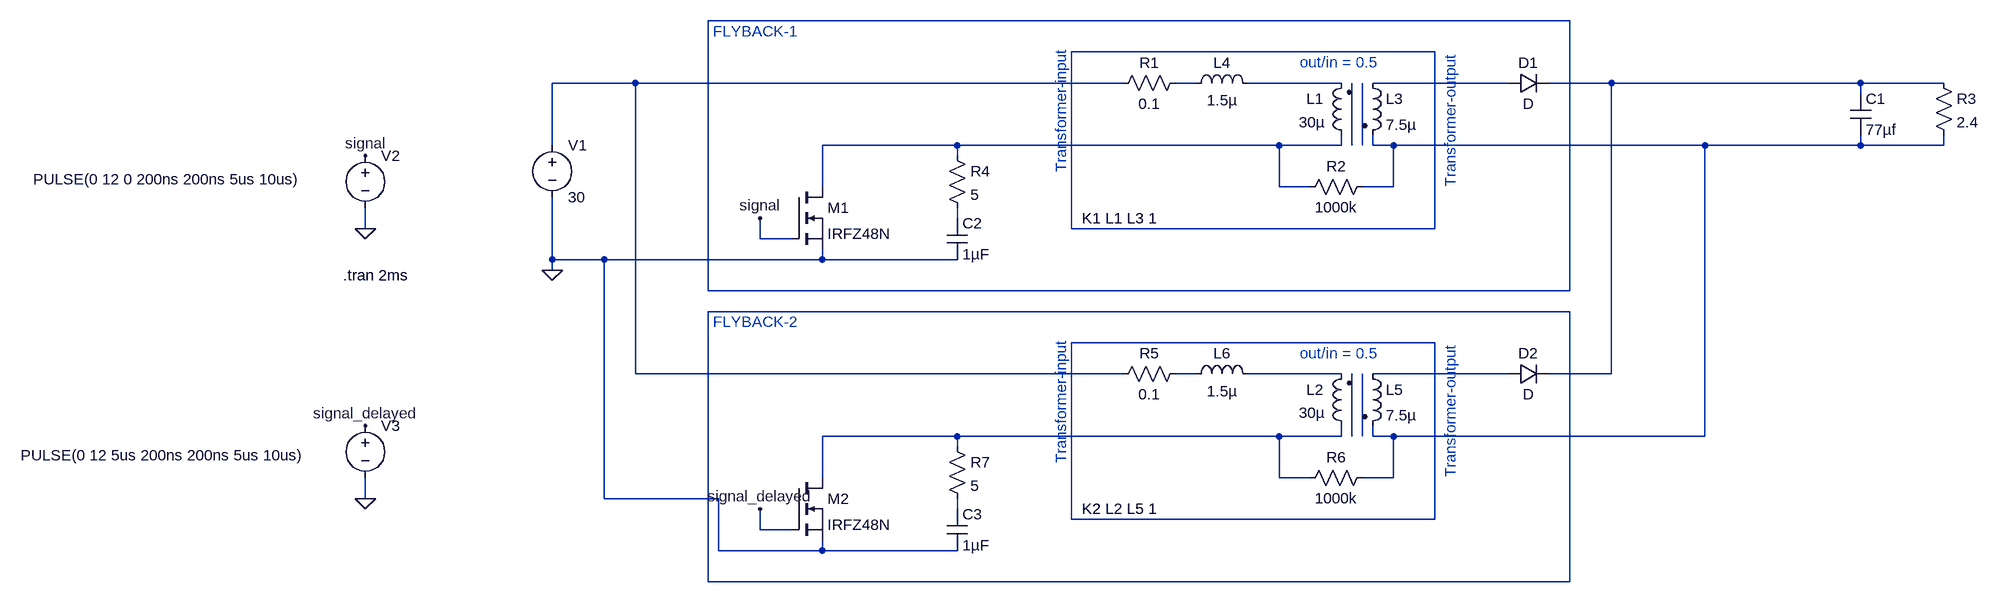
[diagram p0: schematic interleaved_flyback_circuit.asc]
interleaved_flyback_circuit.asc, the LTspice schematic file:
Version 4
SHEET 1 2268 788
WIRE 1632 -80 304 -80
WIRE 1424 -32 864 -32
WIRE 192 16 64 16
WIRE 944 16 192 16
WIRE 1056 16 1024 16
WIRE 1280 16 1136 16
WIRE 1536 16 1328 16
WIRE 1696 16 1600 16
WIRE 2080 16 1696 16
WIRE 2208 16 2080 16
WIRE 2080 32 2080 16
WIRE 64 112 64 16
WIRE 688 112 480 112
WIRE 1184 112 688 112
WIRE 1280 112 1280 96
WIRE 1280 112 1184 112
WIRE 1296 112 1296 16
WIRE 1312 112 1312 16
WIRE 1328 112 1328 96
WIRE 1360 112 1328 112
WIRE 1840 112 1360 112
WIRE 2080 112 2080 96
WIRE 2080 112 1840 112
WIRE 2208 112 2208 96
WIRE 2208 112 2080 112
WIRE 688 128 688 112
WIRE 480 176 480 112
WIRE 1184 176 1184 112
WIRE 1232 176 1184 176
WIRE 1360 176 1360 112
WIRE 1360 176 1312 176
WIRE 688 224 688 208
WIRE -224 240 -224 208
WIRE 864 240 864 -32
WIRE 1424 240 1424 -32
WIRE 1424 240 864 240
WIRE 384 256 384 224
WIRE 432 256 384 256
WIRE 64 288 64 192
WIRE 144 288 64 288
WIRE 480 288 480 272
WIRE 480 288 144 288
WIRE 688 288 480 288
WIRE 64 304 64 288
WIRE 304 336 304 -80
WIRE 1632 336 1632 -80
WIRE 1632 336 304 336
WIRE 1632 368 304 368
WIRE 1424 416 864 416
WIRE 192 464 192 16
WIRE 944 464 192 464
WIRE 1056 464 1024 464
WIRE 1280 464 1136 464
WIRE 1536 464 1328 464
WIRE 1696 464 1696 16
WIRE 1696 464 1600 464
WIRE 688 560 480 560
WIRE 1184 560 688 560
WIRE 1280 560 1280 544
WIRE 1280 560 1184 560
WIRE 1296 560 1296 464
WIRE 1312 560 1312 464
WIRE 1328 560 1328 544
WIRE 1360 560 1328 560
WIRE 1840 560 1840 112
WIRE 1840 560 1360 560
WIRE 688 576 688 560
WIRE 480 624 480 560
WIRE 1184 624 1184 560
WIRE 1232 624 1184 624
WIRE 1360 624 1360 560
WIRE 1360 624 1312 624
WIRE -224 656 -224 624
WIRE 144 656 144 288
WIRE 320 656 144 656
WIRE 688 672 688 656
WIRE 864 688 864 416
WIRE 1424 688 1424 416
WIRE 1424 688 864 688
WIRE 384 704 384 672
WIRE 432 704 384 704
WIRE 320 736 320 656
WIRE 480 736 480 720
WIRE 480 736 320 736
WIRE 688 736 480 736
WIRE 304 784 304 368
WIRE 1632 784 1632 368
WIRE 1632 784 304 784
FLAG 64 304 0
FLAG -224 240 0
FLAG -224 128 signal
FLAG -224 656 0
FLAG -224 544 signal_delayed
FLAG 384 672 signal_delayed
FLAG 384 224 signal
SYMBOL voltage 64 96 R0
WINDOW 123 0 0 Left 0
WINDOW 39 0 0 Left 0
SYMATTR InstName V1
SYMATTR Value 30
SYMBOL voltage -224 112 R0
WINDOW 3 -512 52 Left 2
WINDOW 123 0 0 Left 0
WINDOW 39 0 0 Left 0
SYMATTR InstName V2
SYMATTR Value PULSE(0 12 0 200ns 200ns 5us 10us)
SYMBOL cap 2064 32 R0
SYMATTR InstName C1
SYMATTR Value 77µf
SYMATTR SpiceLine2 IC=12
SYMBOL res 2192 0 R0
SYMATTR InstName R3
SYMATTR Value 2.4
SYMBOL nmos 432 624 R0
SYMATTR InstName M2
SYMATTR Value IRFZ48N
SYMBOL ind2 1296 560 R180
WINDOW 0 43 72 Left 2
WINDOW 3 41 36 Left 2
SYMATTR InstName L2
SYMATTR Value 30µ
SYMATTR Type ind
SYMATTR SpiceLine2 IC=0
SYMBOL ind2 1312 448 R0
SYMATTR InstName L5
SYMATTR Value 7.5µ
SYMATTR Type ind
SYMBOL ind 1040 480 R270
WINDOW 0 32 56 VTop 2
WINDOW 3 5 56 VBottom 2
SYMATTR InstName L6
SYMATTR Value 1.5µ
SYMATTR SpiceLine2 IC=0
SYMBOL res 1040 448 R90
WINDOW 0 0 56 VBottom 2
WINDOW 3 32 56 VTop 2
SYMATTR InstName R5
SYMATTR Value 0.1
SYMBOL res 1328 608 R90
WINDOW 0 0 56 VBottom 2
WINDOW 3 32 56 VTop 2
SYMATTR InstName R6
SYMATTR Value 1000k
SYMBOL diode 1536 480 R270
WINDOW 0 32 32 VTop 2
WINDOW 3 0 32 VBottom 2
SYMATTR InstName D2
SYMBOL res 672 560 R0
SYMATTR InstName R7
SYMATTR Value 5
SYMBOL cap 672 672 R0
SYMATTR InstName C3
SYMATTR Value 1µF
SYMBOL voltage -224 528 R0
WINDOW 3 -531 61 Left 2
WINDOW 123 0 0 Left 0
WINDOW 39 0 0 Left 0
SYMATTR InstName V3
SYMATTR Value PULSE(0 12 5us 200ns 200ns 5us 10us)
SYMBOL nmos 432 176 R0
SYMATTR InstName M1
SYMATTR Value IRFZ48N
SYMBOL ind2 1296 112 R180
WINDOW 0 43 72 Left 2
WINDOW 3 41 36 Left 2
SYMATTR InstName L1
SYMATTR Value 30µ
SYMATTR Type ind
SYMATTR SpiceLine2 IC=0
SYMBOL ind2 1312 0 R0
SYMATTR InstName L3
SYMATTR Value 7.5µ
SYMATTR Type ind
SYMBOL ind 1040 32 R270
WINDOW 0 32 56 VTop 2
WINDOW 3 5 56 VBottom 2
SYMATTR InstName L4
SYMATTR Value 1.5µ
SYMATTR SpiceLine2 IC=0
SYMBOL res 1040 0 R90
WINDOW 0 0 56 VBottom 2
WINDOW 3 32 56 VTop 2
SYMATTR InstName R1
SYMATTR Value 0.1
SYMBOL res 1328 160 R90
WINDOW 0 0 56 VBottom 2
WINDOW 3 32 56 VTop 2
SYMATTR InstName R2
SYMATTR Value 1000k
SYMBOL diode 1536 32 R270
WINDOW 0 32 32 VTop 2
WINDOW 3 0 32 VBottom 2
SYMATTR InstName D1
SYMBOL res 672 112 R0
SYMATTR InstName R4
SYMATTR Value 5
SYMBOL cap 672 224 R0
SYMATTR InstName C2
SYMATTR Value 1µF
TEXT -258 312 Left 2 !.tran 2ms
TEXT 848 408 VRight 2 ;Transformer-input
TEXT 1448 624 VLeft 2 ;Transformer-output
TEXT 1216 432 Left 2 ;out/in = 0.5
TEXT 880 672 Left 2 !K2 L2 L5 1
TEXT 312 384 Left 2 ;FLYBACK-2
TEXT 848 -40 VRight 2 ;Transformer-input
TEXT 1448 176 VLeft 2 ;Transformer-output
TEXT 1216 -16 Left 2 ;out/in = 0.5
TEXT 880 224 Left 2 !K1 L1 L3 1
TEXT 312 -64 Left 2 ;FLYBACK-1

The netlist it stands for:
* interleaved_flyback_circuit.asc
V1 N003 0 30
V2 signal 0 PULSE(0 12 0 200ns 200ns 5us 10us)
C1 N007 N011 77µf IC=12
R3 N007 N011 2.4
M2 N018 signal_delayed 0 0 IRFZ48N
L2 N018 N016 30µ IC=0
L5 N017 N011 7.5µ
L6 N015 N016 1.5µ IC=0
R5 N015 N003 0.1
R6 N011 N018 1000k
D2 N017 N007 D
R7 N018 N021 5
C3 N021 0 1µF
V3 signal_delayed 0 PULSE(0 12 5us 200ns 200ns 5us 10us)
M1 N008 signal 0 0 IRFZ48N
L1 N008 N005 30µ IC=0
L3 N006 N011 7.5µ
L4 N004 N005 1.5µ IC=0
R1 N004 N003 0.1
R2 N011 N008 1000k
D1 N006 N007 D
R4 N008 N012 5
C2 N012 0 1µF
.model D D
.lib standard.dio
.model NMOS NMOS
.model PMOS PMOS
.lib standard.mos
.tran 2ms
* Transformer-input
* Transformer-output
* out/in = 0.5
K2 L2 L5 1
* FLYBACK-2
* Transformer-input
* Transformer-output
* out/in = 0.5
K1 L1 L3 1
* FLYBACK-1
.backanno
.end